# Altium schematic sheet serial-io.SchDoc
size A
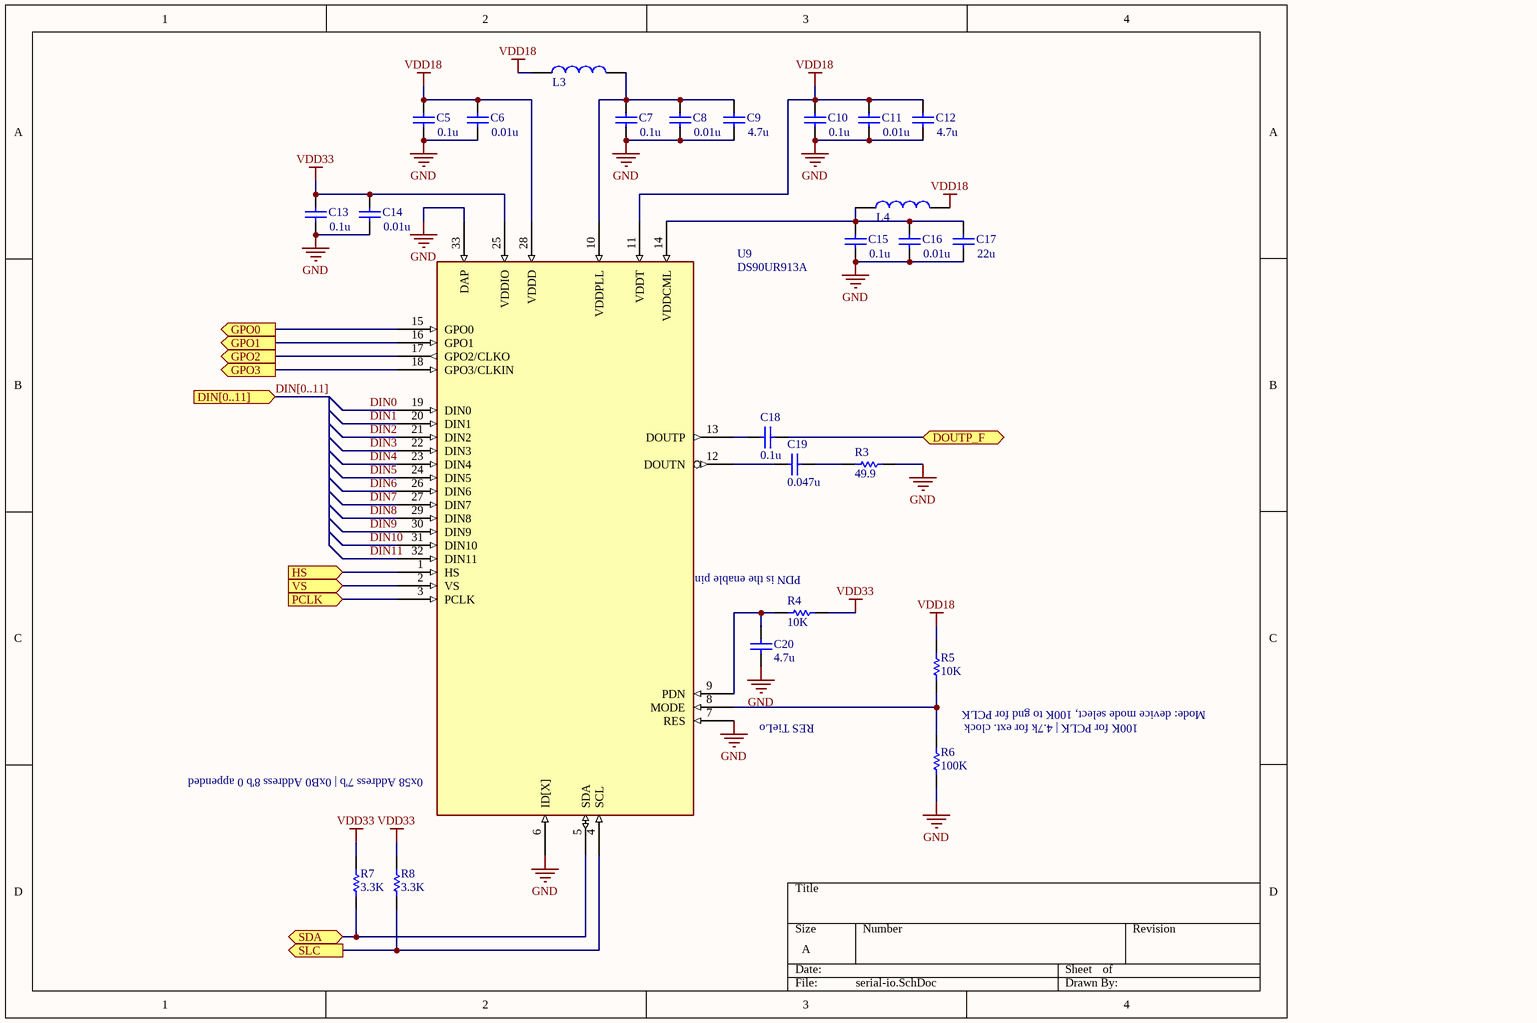
[diagram p0: serial-io.SchDoc]

## Parts
C5  value 0.1u  [Cap_0402]  (hidden comment: X7R Ceramic)
C6  value 0.01u  [Cap_0402]  (hidden comment: X7R Ceramic)
C7  value 0.1u  [Cap_0402]  (hidden comment: X7R Ceramic)
C8  value 0.01u  [Cap_0402]  (hidden comment: X7R Ceramic)
C9  value 4.7u  [Cap_0402]  (hidden comment: X7R Ceramic)
C10  value 0.1u  [Cap_0402]  (hidden comment: X7R Ceramic)
C11  value 0.01u  [Cap_0402]  (hidden comment: X7R Ceramic)
C12  value 4.7u  [Cap_0402]  (hidden comment: X7R Ceramic)
C13  value 0.1u  [Cap_0402]  (hidden comment: X7R Ceramic)
C14  value 0.01u  [Cap_0402]  (hidden comment: X7R Ceramic)
C15  value 0.1u  [Cap_0402]  (hidden comment: X7R Ceramic)
C16  value 0.01u  [Cap_0402]  (hidden comment: X7R Ceramic)
C17  value 22u  [Cap-0603]  (hidden comment: X7R Ceramic)
C18  value 0.1u  [Cap_0402]  (hidden comment: X7R Ceramic)
C19  value 0.047u  [Cap_0402]  (hidden comment: X7R Ceramic)
C20  value 4.7u  [Cap_0402]  (hidden comment: X7R Ceramic)
L3  Ferrite Bead  [BLM18KG601SN1D]  (value not drawn)
L4  Ferrite Bead  [BLM18KG601SN1D]  (value not drawn)
R3  value 49.9  [Res_0402]  (hidden comment: Res1)
R4  value 10K  [Res_0402]  (hidden comment: Res1)
R5  value 10K  [Res_0402]  (hidden comment: Res1)
R6  value 100K  [Res_0402]  (hidden comment: Res1)
R7  value 3.3K  [Res_0402]  (hidden comment: Res1)
R8  value 3.3K  [Res_0402]  (hidden comment: Res1)
U9  DS90UR913A  [WQFN32-DS90UB913A]

## Ports
DIN[0..11] (in), DOUTP_F (bidir), GPO0 (out), GPO1 (out), GPO2 (out), GPO3 (out), HS (in), PCLK (in), SDA (bidir), SLC (out), VS (in)

## Nets
GND: C5.1 C6.1 C7.1 C8.1 C9.1 C10.1 C11.1 C12.1 C13.1 C14.1 C15.1 C16.1 C17.1 C20.1 R3.2 R6.1 U9.6(ID[X]) U9.7(RES) U9.33(DAP)
VDD18: C5.2 C6.2 C10.2 C11.2 C12.2 L3.1 L4.2 R5.2 U9.11(VDDT) U9.28(VDDD)
VDD33: C13.2 C14.2 R4.2 R7.2 R8.2 U9.25(VDDIO)
DIN0: U9.19(DIN0)
DIN1: U9.20(DIN1)
DIN2: U9.21(DIN2)
DIN3: U9.22(DIN3)
DIN4: U9.23(DIN4)
DIN5: U9.24(DIN5)
DIN6: U9.26(DIN6)
DIN7: U9.27(DIN7)
DIN8: U9.29(DIN8)
DIN9: U9.30(DIN9)
DIN10: U9.31(DIN10)
DIN11: U9.32(DIN11)
DOUTP_F: C18.1 ; port DOUTP_F
GPO0: U9.15(GPO0) ; port GPO0
GPO1: U9.16(GPO1) ; port GPO1
GPO2: U9.17(GPO2/CLKO) ; port GPO2
GPO3: U9.18(GPO3/CLKIN) ; port GPO3
HS: U9.1(HS) ; port HS
PCLK: U9.3(PCLK) ; port PCLK
SDA: R7.1 U9.5(SDA) ; port SDA
SLC: R8.1 U9.4(SCL) ; port SLC
VS: U9.2(VS) ; port VS
NetC7_2: C7.2 C8.2 C9.2 L3.2 U9.10(VDDPLL)
NetC15_2: C15.2 C16.2 C17.2 L4.1 U9.14(VDDCML)
NetC18_2: C18.2 U9.13(DOUTP)
NetC19_1: C19.1 R3.1
NetC19_2: C19.2 U9.12(DOUTN)
NetC20_2: C20.2 R4.1 U9.9(PDN)
NetR5_1: R5.1 R6.2 U9.8(MODE)

## Buses and harness runs
bus DIN[0..11] = port DIN[0..11]

## Notes on the sheet
- (near U9) PDN is the enable pin
- Mode: device mode select, 100K to gnd for PCLK
- (near U9) 0x58 Address 7'b | 0xB0 Address 8'b 0 appended
- RES TieLo
- (near R6) 100K for PCLK | 4.7k for ext. clock

## Library data of the parts
C5-C20 = Cap: Capacitor; Published: 8-Jun-2000; LatestRevisionDate: 17-Jul-2002; LatestRevisionNote: Re-released for DXP Platform.; PackageReference: RAD-0.3; Publisher: Altium Limited; PackageDescription: Radial Cap, Thru-Hole; 2 Leads; 0.3 in Pin Spacing
R3-R8 = Res1: Resistor; Published: 8-Jun-2000; LatestRevisionDate: 17-Jul-2002; LatestRevisionNote: Re-released for DXP Platform.; PackageReference: AXIAL-0.3; Publisher: Altium Limited; PackageDescription: Axial Device, Thru-Hole; 2 Leads; 0.3 in Pin Spacing
U9 = DS90UR913A: DS90UR913ASERIALIZER